# Altium schematic sheet RP2350B.SchDoc
size A4; SheetNumber: 1; SheetTotal: 1
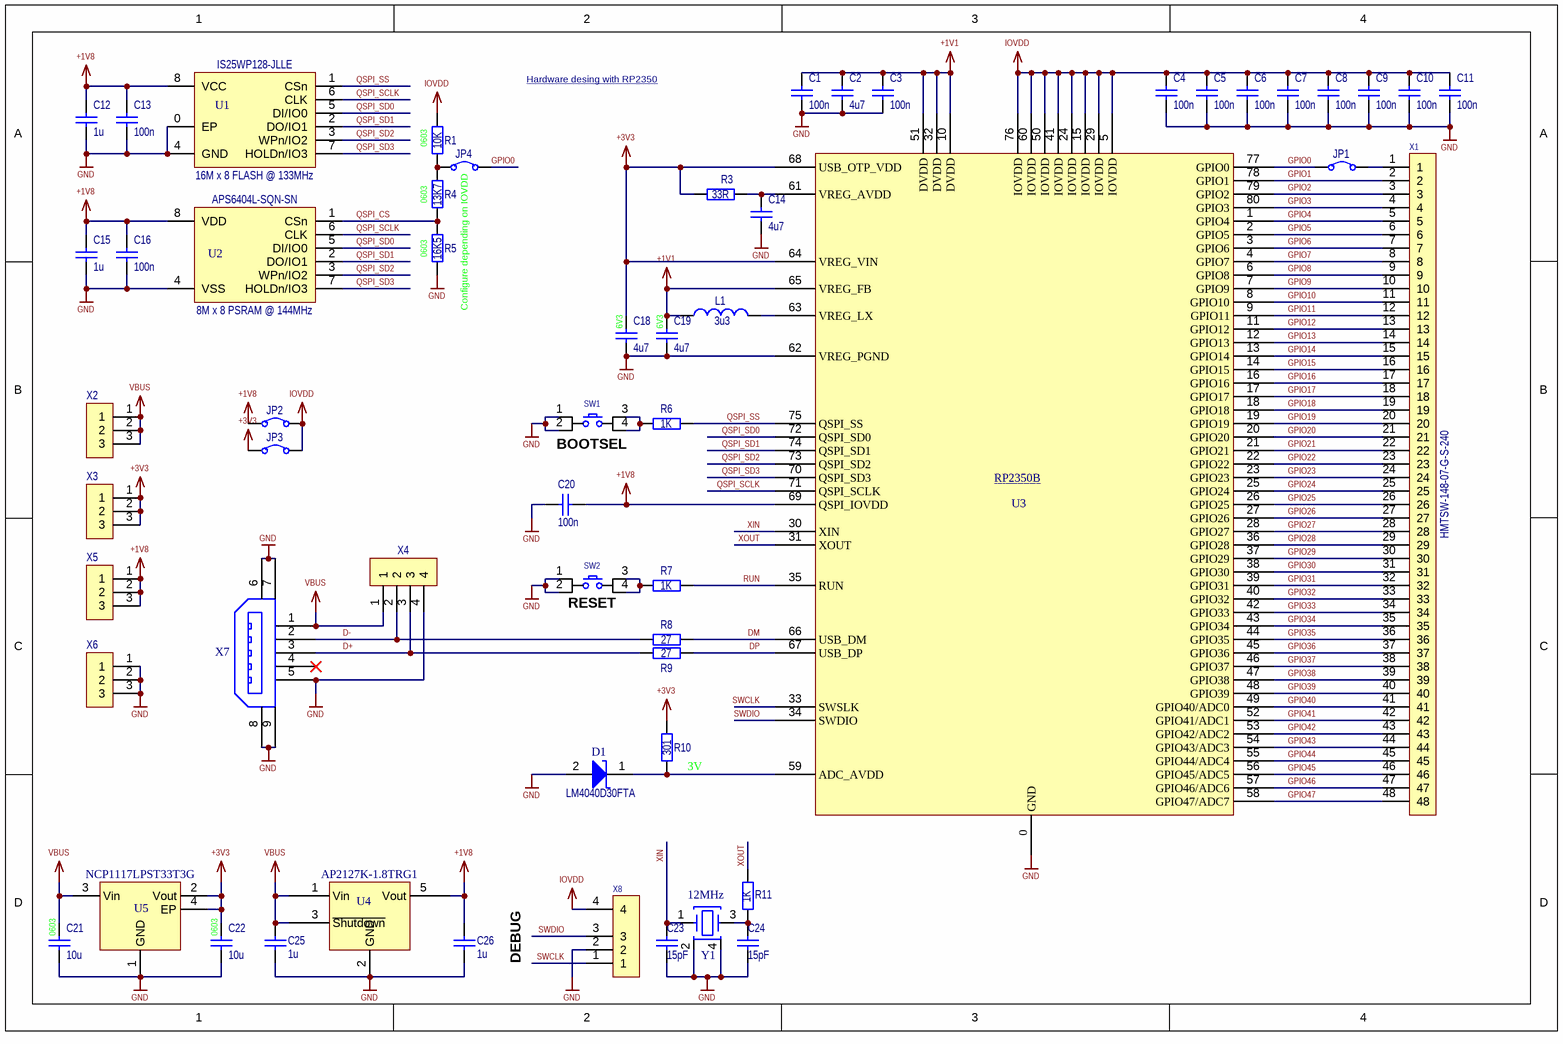
[diagram p0: RP2350B.SchDoc]

## Parts
C1  value 100n  [CAPC0402]  (hidden comment: C0402C104J8RACTU)
C2  value 4u7  [CAPC0402]  (hidden comment: CL05A475KP5NRNC)
C3  value 100n  [CAPC0402]  (hidden comment: C0402C104J8RACTU)
C4  value 100n  [CAPC0402]  (hidden comment: C0402C104J8RACTU)
C5  value 100n  [CAPC0402]  (hidden comment: C0402C104J8RACTU)
C6  value 100n  [CAPC0402]  (hidden comment: C0402C104J8RACTU)
C7  value 100n  [CAPC0402]  (hidden comment: C0402C104J8RACTU)
C8  value 100n  [CAPC0402]  (hidden comment: C0402C104J8RACTU)
C9  value 100n  [CAPC0402]  (hidden comment: C0402C104J8RACTU)
C10  value 100n  [CAPC0402]  (hidden comment: C0402C104J8RACTU)
C11  value 100n  [CAPC0402]  (hidden comment: C0402C104J8RACTU)
C12  value 1u  [CAPC0402]  (hidden comment: CL05A105KP5NNNC)
C13  value 100n  [CAPC0402]  (hidden comment: C0402C104J8RACTU)
C14  value 4u7  [CAPC0402]  (hidden comment: CL05A475KP5NRNC)
C15  value 1u  [CAPC0402]  (hidden comment: CL05A105KP5NNNC)
C16  value 100n  [CAPC0402]  (hidden comment: C0402C104J8RACTU)
C18  6V3  value 4u7  [CAPC0603]
C19  6V3  value 4u7  [CAPC0603]
C20  value 100n  [CAPC0402]  (hidden comment: C0402C104J8RACTU)
C21  0603  value 10u  [CAPC0603]
C22  0603  value 10u  [CAPC0603]
C23  value 15pF  [CAPC0402]  (hidden comment: GJM1555C1H3R0BB01D)
C24  value 15pF  [CAPC0402]  (hidden comment: GJM1555C1H3R0BB01D)
C25  value 1u  [CAPC0402]  (hidden comment: CL05A105KP5NNNC)
C26  value 1u  [CAPC0402]  (hidden comment: CL05A105KP5NNNC)
D1  LM4040D30FTA  value 3V  [SOT23-3]
JP1  5110 Keystone  [JumperSMD_0603]  (value not drawn)  (no BOM)
JP2  5110 Keystone  [JumperSMD_0603]  (value not drawn)  (no BOM)
JP3  5110 Keystone  [JumperSMD_0603]  (value not drawn)  (no BOM)
JP4  5110 Keystone  [JumperSMD_0603]  (value not drawn)  (no BOM)
L1  value 3u3  [IND_0806]  (hidden comment: IND_3u3_2X1.6mm_1.4A_20%)
R1  0603  value 10K  [RESC0603]
R3  value 33R  [RESC0402]  (hidden comment: RC0402FR-0733RL)
R4  0603  value 13K7  [RESC0603]
R5  0603  value 16K5  [RESC0603]
R6  value 1K  [RESC0402]  (hidden comment: RC0402FR-071KL)
R7  value 1K  [RESC0402]  (hidden comment: RC0402FR-071KL)
R8  value 27  [RESC0402]  (hidden comment: CRCW040214K3FKED)
R9  value 27  [RESC0402]  (hidden comment: CRCW040214K3FKED)
R10  value 301  [RESC0402]  (hidden comment: 301R_0402_63mW_1%_100ppm)
R11  value 1K  [RESC0402]  (hidden comment: RC0402FR-071KL)
SW1  434133025816  [434133025816]  (value not drawn)
SW2  434133025816  [434133025816]  (value not drawn)
U1  value 16M x 8 FLASH @ 133MHz  [WSON8-6x8]  (hidden comment: IS25WP128-JLLE)
U2  value 8M x 8 PSRAM @ 144MHz  [SOP-8L (150)]  (hidden comment: APS6404L-SQN-SN)
U3  RP2350B  [QFN-80]  (value not drawn)
U4  AP2127K-1.8TRG1  [SOT23-5]
U5  NCP1117LPST33T3G  [SOT-232-4]
X1  HMTSW-148-07-G-S-240  [HDR_TH_1X48_M_00]
X2  825433-3  [HDR_TH_1X3_M_00]  (value not drawn)
X3  825433-3  [HDR_TH_1X3_M_00]  (value not drawn)
X4  HMTSW-104-07-G-S-240  [HDR_TH_1X4_M_00]  (value not drawn)
X5  825433-3  [HDR_TH_1X3_M_00]  (value not drawn)
X6  825433-3  [HDR_TH_1X3_M_00]  (value not drawn)
X7  1734327-1  [1734327-1]  (value not drawn)
X8  HMTSW-106-07-G-S-240  [HDR_TH_1X3+0+1_M_00]  (value not drawn)
Y1  value 12MHz  [ABM8]  (hidden comment: ABM8-272-T3)

## Nets
+1V1: C1.2 C2.2 C3.2 C19.2 L1.1 U3.10(DVDD) U3.32(DVDD) U3.51(DVDD) U3.65(VREG_FB)
+1V8: C12.1 C13.2 C15.1 C16.2 C20.2 C26.1 JP2.1 U1.8(VCC) U2.8(VDD) U3.69(QSPI_IOVDD) U4.5(Vout) X5.1 X5.2 X5.3
+3V3: C18.2 C22.2 JP3.1 R3.1 R10.2 U3.64(VREG_VIN) U3.68(USB_OTP_VDD) U5.2(Vout) U5.4(EP) X3.1 X3.2 X3.3
GND: C1.1 C2.1 C3.1 C4.1 C5.1 C6.1 C7.1 C8.1 C9.1 C10.1 C11.1 C12.2 C13.1 C14.1 C15.2 C16.1 C18.1 C19.1 C20.1 C21.1 C22.1 C23.1 C24.1 C25.2 C26.2 D1.2(Anode) R5.1 SW1.1 SW1.2 SW2.1 SW2.2 U1.0(EP) U1.4(GND) U2.4(VSS) U3.0(GND) U3.62(VREG_PGND) U4.2(GND) U5.1(GND) X4.4 X6.1 X6.2 X6.3 X7.5 X7.6 X7.7 X7.8 X7.9 X8.2 Y1.2(GND) Y1.4(GND)
IOVDD: C4.2 C5.2 C6.2 C7.2 C8.2 C9.2 C10.2 C11.2 JP2.2 JP3.2 R1.2 U3.5(IOVDD) U3.15(IOVDD) U3.24(IOVDD) U3.29(IOVDD) U3.41(IOVDD) U3.50(IOVDD) U3.60(IOVDD) U3.76(IOVDD) X8.4
VBUS: C21.2 C25.1 U4.1(Vin) U4.3(~{Shutdown}) U5.3(Vin) X2.1 X2.2 X2.3 X4.1 X7.1
D+: R9.1 X4.3 X7.3
D-: R8.1 X4.2 X7.2
DM: R8.2 U3.66(USB_DM)
DP: R9.2 U3.67(USB_DP)
GPIO0: JP1.1 JP4.2 U3.77(GPIO0)
GPIO1: U3.78(GPIO1) X1.2
GPIO2: U3.79(GPIO2) X1.3
GPIO3: U3.80(GPIO3) X1.4
GPIO4: U3.1(GPIO4) X1.5
GPIO5: U3.2(GPIO5) X1.6
GPIO6: U3.3(GPIO6) X1.7
GPIO7: U3.4(GPIO7) X1.8
GPIO8: U3.6(GPIO8) X1.9
GPIO9: U3.7(GPIO9) X1.10
GPIO10: U3.8(GPIO10) X1.11
GPIO11: U3.9(GPIO11) X1.12
GPIO12: U3.11(GPIO12) X1.13
GPIO13: U3.12(GPIO13) X1.14
GPIO14: U3.13(GPIO14) X1.15
GPIO15: U3.14(GPIO15) X1.16
GPIO16: U3.16(GPIO16) X1.17
GPIO17: U3.17(GPIO17) X1.18
GPIO18: U3.18(GPIO18) X1.19
GPIO19: U3.19(GPIO19) X1.20
GPIO20: U3.20(GPIO20) X1.21
GPIO21: U3.21(GPIO21) X1.22
GPIO22: U3.22(GPIO22) X1.23
GPIO23: U3.23(GPIO23) X1.24
GPIO24: U3.25(GPIO24) X1.25
GPIO25: U3.26(GPIO25) X1.26
GPIO26: U3.27(GPIO26) X1.27
GPIO27: U3.28(GPIO27) X1.28
GPIO28: U3.36(GPIO28) X1.29
GPIO29: U3.37(GPIO29) X1.30
GPIO30: U3.38(GPIO30) X1.31
GPIO31: U3.39(GPIO31) X1.32
GPIO32: U3.40(GPIO32) X1.33
GPIO33: U3.42(GPIO33) X1.34
GPIO34: U3.43(GPIO34) X1.35
GPIO35: U3.44(GPIO35) X1.36
GPIO36: U3.45(GPIO36) X1.37
GPIO37: U3.46(GPIO37) X1.38
GPIO38: U3.47(GPIO38) X1.39
GPIO39: U3.48(GPIO39) X1.40
GPIO40: U3.49(GPIO40/ADC0) X1.41
GPIO41: U3.52(GPIO41/ADC1) X1.42
GPIO42: U3.53(GPIO42/ADC2) X1.43
GPIO43: U3.54(GPIO43/ADC3) X1.44
GPIO44: U3.55(GPIO44/ADC4) X1.45
GPIO45: U3.56(GPIO45/ADC5) X1.46
GPIO46: U3.57(GPIO46/ADC6) X1.47
GPIO47: U3.58(GPIO47/ADC7) X1.48
QSPI_CS: R4.1 R5.2 U2.1(CSn)
QSPI_SCLK: U1.6(CLK) U2.6(CLK) U3.71(QSPI_SCLK)
QSPI_SD0: U1.5(DI/IO0) U2.5(DI/IO0) U3.72(QSPI_SD0)
QSPI_SD1: U1.2(DO/IO1) U2.2(DO/IO1) U3.74(QSPI_SD1)
QSPI_SD2: U1.3(WPn/IO2) U2.3(WPn/IO2) U3.73(QSPI_SD2)
QSPI_SD3: U1.7(HOLDn/IO3) U2.7(HOLDn/IO3) U3.70(QSPI_SD3)
QSPI_SS: R6.2 U1.1(CSn) U3.75(QSPI_SS)
RUN: R7.2 U3.35(RUN)
SWCLK: U3.33(SWSLK) X8.1
SWDIO: U3.34(SWDIO) X8.3
XIN: C23.2 U3.30(XIN) Y1.1(IN)
XOUT: R11.2 U3.31(XOUT)
NetC14_2: C14.2 R3.2 U3.61(VREG_AVDD)
NetC24_2: C24.2 R11.1 Y1.3(OUT)
NetD1_1: D1.1(Cathode) R10.1 U3.59(ADC_AVDD)
NetJP1_2: JP1.2 X1.1
NetJP4_1: JP4.1 R1.1 R4.2
NetL1_2: L1.2 U3.63(VREG_LX)
NetR6_1: R6.1 SW1.3 SW1.4
NetR7_1: R7.1 SW2.3 SW2.4

Not connected (* = marked no-connect by the designer): X7 4*

## Notes on the sheet
- Hardware desing with RP2350 <https://datasheets.raspberrypi.com/rp2350/hardware-design-with-rp2350.pdf>
- (near JP4) Configure depending on IOVDD
- (near SW1) BOOTSEL
- (near SW2) RESET
- (near C26) DEBUG
- designed by
- reviewed by
- last drawn by
- Workspace:
- Altium Rev.:
- Project:
- Schematic:
- last printed
- DIN-A4 L
- Rev.
- sheets
- of
- File:

## Library data of the parts
C1 = 100n_0402_10V_X7R_5%: Capacitor; Ceramic; 100n; 2; 10V; X7R; 5%; -55°C ~ 125°C; Manufacturer 1: KEMET; Manufacturer Part Number 1: C0402C104J8RACTU; Supplier 1: DigiKey; Supplier Part Number 1: 399-8942-6-ND; ComponentLink1Description: Datasheet; ComponentLink1URL: https://content.kemet.com/datasheets/KEM_C1002_X7R_SMD.pdf; ComponentLink2Description: Supplier Info; ComponentLink2URL: https://www.digikey.com/en/products/detail/kemet/C0402C104J8RACTU/2196231?s=N4IgTCBcDaIMwE4EFoAcCAsZkDZkDkAREAXQF8g
C2 C14 = 4u7_0402_10V_X5R_10%: Capacitor; Ceramic; 4.7u; 0402; 10V; X5R; 10%; -55°C ~ 85°C; Manufacturer: Samsung Electro-Mechanics; Manufacturer Part Number: CL05A475KP5NRNC; Supplier 1: DigiKey; Supplier Part Number 1: 1276-1480-6-ND; ComponentLink1Description: Datasheet; ComponentLink1URL: https://media.digikey.com/pdf/Data%20Sheets/Samsung%20PDFs/CL05A475KP5NRNC_Spec.pdf; ComponentLink2Description: Supplier Info; ComponentLink2URL: https://www.digikey.com/en/products/detail/samsung-electro-mechanics/CL05A475KP5NRNC/3887138?s=N4IgTCBcDaIIxgOwDYC0cAsAOADKtAcgCIgC6AvkA
C3-C11 C13 C16 C20 = 100n_0402_10V_X7R_5%: Capacitor; Ceramic; 100n; 0402; 10V; X7R; 5%; -55°C ~ 125°C; Manufacturer 1: KEMET; Manufacturer Part Number 1: C0402C104J8RACTU; Supplier 1: DigiKey; Supplier Part Number 1: 399-8942-6-ND; ComponentLink1Description: Datasheet; ComponentLink1URL: https://content.kemet.com/datasheets/KEM_C1002_X7R_SMD.pdf; ComponentLink2Description: Supplier Info; ComponentLink2URL: https://www.digikey.com/en/products/detail/kemet/C0402C104J8RACTU/2196231?s=N4IgTCBcDaIMwE4EFoAcCAsZkDZkDkAREAXQF8g
C12 C15 C25 C26 = 1u_0402_10V_X5R_10%: Capacitor; Ceramic; 1u; 0402; 10V; X5R; 10%; -55°C ~ 85°C; Manufacturer: Samsung Electro-Mechanics; Manufacturer Part Number: CL05A105KP5NNNC; Supplier 1: DigiKey; Supplier Part Number 1: 1276-1076-6-ND; ComponentLink1Description: Datasheet; ComponentLink1URL: https://www.samsungsem.com/resources/file/global/support/product_catalog/MLCC.pdf; ComponentLink2Description: Supplier Info; ComponentLink2URL: https://www.digikey.com/en/products/detail/samsung-electro-mechanics/CL05A105KP5NNNC/3886734?s=N4IgTCBcDaIIxgOwDYC0cAMLVoHIBEQBdAXyA
C18 C19 = 4u7_0603_6V3_X7S_10%: Capacitor; Ceramic; 4.7u; 0603; 6.3V; X7S; 10%; -55°C ~ 125°C; Manufacturer: Murata Electronics; Manufacturer Part Number: GCJ188C70J475KE02D; Supplier 1: DigiKey; Supplier Part Number 1: 490-16480-1-ND; ComponentLink1Description: Datasheet; ComponentLink1URL: https://search.murata.co.jp/Ceramy/image/img/A01X/G101/ENG/GCJ188C70J475KE02-01.pdf; ComponentLink2Description: Supplier Info; ComponentLink2URL: https://www.digikey.de/en/products/detail/murata-electronics/GCJ188C70J475KE02D/7363224
C21 C22 = 10u_0603_16V_X5R_10%: Capacitor; Ceramic; 10u; 0603; 16V; X5R; 10%; -55°C ~ 85°C; Manufacturer 1: Murata Electronics; Manufacturer Part Number 1: GRM188R61C106KAALD; Supplier 1: DigiKey; Supplier Part Number 1: 490-10728-6-ND; ComponentLink1Description: Datasheet; ComponentLink1URL: https://search.murata.co.jp/Ceramy/image/img/A01X/G101/ENG/GRM188R61C106KAAL-01.pdf; ComponentLink2Description: Supplier Info; ComponentLink2URL: https://www.digikey.com/en/products/detail/murata-electronics/GRM188R61C106KAALD/4905338?s=N4IgTCBcDaICwE4AMBaAjEg7GAHCgbCgHIAiIAugL5A
C23 C24 = 15p_0402_25V_C0G/NP0_5%: Capacitor; Ceramic; 15p; 0402; 25V; C0G/NP0; +/-5%; -55°C ~ 125°C; Manufacturer: YAGEO; Manufacturer Part Number: CC0402JRNPO8BN150; Supplier 1: DigiKey; Supplier Part Number 1: 311-3746-1-ND; ComponentLink1Description: Datasheet; ComponentLink1URL: https://www.yageo.com/upload/media/product/productsearch/datasheet/mlcc/UPY-GP_NP0_16V-to-50V_18.pdf; ComponentLink2Description: Supplier Info; ComponentLink2URL: https://www.digikey.de/en/products/detail/yageo/CC0402JRNPO8BN150/5883268
D1 = LM4040D30FTA: Shunt Voltage Reference IC Fixed 3V ±1% 15 mA SOT-23-3; Manufacturer: Diodes Incorporated; ComponentLink1Description: Datasheet; ComponentLink1URL: https://www.diodes.com/assets/Datasheets/LM4040.pdf; ComponentLink2Description: Supplier Info; ComponentLink2URL: https://www.digikey.de/en/products/detail/diodes-incorporated/LM4040D30FTA/4249974; Manufacturer Part Number: LM4040D30FTA; Supplier 1: Digi-Key; Supplier Part Number 1: LM4040D30FTADICT-ND
JP1-JP4 = JMP_0R_0603: Jumper; Chip; 0R; 0603; 500mW; Manufacturer Part Number: 5110; ComponentLink1Description: Datasheet; ComponentLink1URL: https://www.keyelco.com/userAssets/file/M65p54.pdf; ComponentLink2Description: Supplier Info; ComponentLink2URL: https://www.digikey.com/en/products/detail/keystone-electronics/5110/5118870?s=N4IgTCBcDaINIFMCeBnALgewHYIAQFYBGQgBhAF0BfIA; Manufacturer: Keystone; Supplier 1: DigiKey; Supplier Part Number 1: 36-5110CT-ND; Value: 0R
L1 = IND_3u3_2X1.6mm_1.4A_20%: 3.3 µH Shielded Inductor 1.4 A 225mOhm Max 0806; Manufacturer: Bourns Inc.; Manufacturer Part Number: SRP2010DPA-3R3M; ComponentLink1Description: Supplier Info; ComponentLink1URL: https://www.digikey.de/en/products/detail/bourns-inc/SRP2010DPA-3R3M/16185975?s=N4IgTCBcDaIMoCUAKYAMBGVARJBBAtAMwKECyIAugL5A; ComponentLink2Description: Datasheet; ComponentLink2URL: https://mm.digikey.com/Volume0/opasdata/d220001/medias/docus/5338/SRP2010DPA_Series_DS.pdf; Supplier 1: Digi-Key; Supplier Part Number 1: 118-SRP2010DPA-3R3MCT-ND
R1 = 10K_0603_100mW_1%_100ppm: Resistor; Chip; 10k; 0603; 75V; 1%; 100ppm; 100mW; -55°C ~ 155°C; Manufacturer 1: Yageo; Manufacturer Part Number 1: RC0603FR-0710KL; Supplier 1: DigiKey; Supplier Part Number 1: 311-10.0KHRDKR-ND; ComponentLink1Description: Datasheet; ComponentLink1URL: https://www.yageo.com/upload/media/product/productsearch/datasheet/rchip/PYu-RC_Group_51_RoHS_L_11.pdf; ComponentLink2Description: Supplier Info; ComponentLink2URL: https://www.digikey.com/en/products/detail/yageo/RC0603FR-0710KL/726880?s=N4IgTCBcDaIMwEYEFoEAYB0aDSAJASgCLb7IByhIAugL5A
R3 = 33R_0402_63mW_1%_100ppm: Resistor; Chip; 33R; 0402; 50V; 1%; 100ppm; 63mW; -55°C ~ 155°C; Manufacturer: Yageo; Manufacturer Part Number: RC0402FR-0733RL; Supplier 1: DigiKey; Supplier Part Number 1: 311-33.0LRDKR-ND; ComponentLink1Description: Datasheet; ComponentLink1URL: https://www.yageo.com/upload/media/product/productsearch/datasheet/rchip/PYu-RC_Group_51_RoHS_L_11.pdf; ComponentLink2Description: Supplier Info; ComponentLink2URL: https://www.digikey.com/en/products/detail/yageo/RC0402FR-0733RL/726593?s=N4IgTCBcDaIMwEYEFo5wHQAYAyAlAIgNK7IBy%2BIAugL5A
R4 = 13K7_0603_100mW_0.1%_25ppm: Resistor; Chip; 13K7; 0603; 0.1%; 25ppm; 100mW; -55°C ~ 155°C; Manufacturer: YAGEO; Manufacturer Part Number: RT0603BRD0713K7L; Supplier 1: DigiKey; ComponentLink1Description: Datasheet; ComponentLink1URL: https://www.yageo.com/upload/media/product/app/datasheet/rchip/pyu-rt_1-to-0.01_rohs_l.pdf; ComponentLink2Description: Supplier Info; ComponentLink2URL: https://www.digikey.de/en/products/detail/yageo/RT0603BRD0713K7L/1072241; Supplier Part Number 1: YAG4473CT-ND
R5 = 16K5_0603_100mW_0.1%_25ppm: Resistor; Chip; 16K5; 0603; 0.1%; 25ppm; 100mW; -55°C ~ 155°C; Manufacturer: YAGEO; Manufacturer Part Number: RT0603BRD0716K5L; Supplier 1: DigiKey; ComponentLink1Description: Datasheet; ComponentLink1URL: https://www.yageo.com/upload/media/product/app/datasheet/rchip/pyu-rt_1-to-0.01_rohs_l.pdf; ComponentLink2Description: Supplier Info; ComponentLink2URL: https://www.digikey.de/en/products/detail/yageo/RT0603BRD0716K5L/1072278; Supplier Part Number 1: YAG1544CT-ND
R6 R7 R11 = 1K_0402_63mW_1%_100ppm: Resistor; Chip; 1k; 0402; 50V; 1%; 100ppm; 63mW; -55°C ~ 155°C; Manufacturer: Yageo; Manufacturer Part Number: RC0402FR-071KL; Supplier 1: DigiKey; Supplier Part Number 1: 311-1.00KLRDKR-ND; ComponentLink1Description: Datasheet; ComponentLink1URL: https://www.yageo.com/upload/media/product/productsearch/datasheet/rchip/PYu-RC_Group_51_RoHS_L_11.pdf; ComponentLink2Description: Supplier Info; ComponentLink2URL: https://www.digikey.com/en/products/detail/yageo/RC0402FR-071KL/726513?s=N4IgTCBcDaIMwEYEFoEDoAMGDSAZASgCLb7IByhIAugL5A
R8 R9 = 27R_0402_63mW_1%_100ppm: Resistor; Chip; 27Ohm; 0402; 1%; 100ppm; 63mW; -55°C ~ 155°C; Manufacturer: YAGEO; Manufacturer Part Number: RC0402FR-0727RL; Supplier 1: DigiKey; Supplier Part Number 1: YAG3086CT-ND; ComponentLink1Description: Datasheet; ComponentLink1URL: https://www.yageo.com/upload/media/product/products/datasheet/rchip/PYu-RC_Group_51_RoHS_L_12.pdf; ComponentLink2Description: Supplier Info; ComponentLink2URL: https://www.digikey.de/en/products/detail/yageo/RC0402FR-0727RL/5280946
R10 = 301R_0402_63mW_1%_100ppm: Resistor; Chip; 301R; 0402; 1%; 100ppm; 63mW; -55°C ~ 155°C; Manufacturer: YAGEO; Manufacturer Part Number: RC0402FR-07301RL; Supplier 1: DigiKey; ComponentLink1Description: Datasheet; ComponentLink1URL: https://www.yageo.com/upload/media/product/products/datasheet/rchip/PYu-RC_Group_51_RoHS_L_12.pdf; ComponentLink2Description: Supplier Info; ComponentLink2URL: https://www.digikey.de/en/products/detail/yageo/RC0402FR-07301RL/726591; Supplier Part Number 1: 311-301LRCT-ND
SW1 SW2 = 434133025816: SWITCH TACTILE SPST-NO 0.05A 16V; Manufacturer: Würth Elektronik; ComponentLink1Description: Datasheet; ComponentLink1URL: https://www.we-online.com/components/products/datasheet/434133025816.pdf; ComponentLink2Description: Supplier Info; ComponentLink2URL: https://www.digikey.de/en/products/detail/w%C3%BCrth-elektronik/434133025816/9950810?s=N4IgTCBcDaICwGY4EYEIAxgKwA5kDYQBdAXyA; Manufacturer Part Number: 434133025816; Supplier 1: Digi-Key; Supplier Part Number 1: 732-13663-1-ND
U1 = IS25WP128-JLLE: IC FLASH 128MBIT SPI/QUAD 8WSON; Manufacturer: ISSI, Integrated Silicon Solution Inc; ComponentLink1Description: Datasheet; ComponentLink1URL: https://www.issi.com/WW/pdf/25WP128.pdf; ComponentLink2Description: Supplier Info; ComponentLink2URL: https://www.digikey.de/en/products/detail/issi-integrated-silicon-solution-inc/IS25WP128-JLLE/7567476; Supplier 1: Digi-Key; Supplier Part Number 1: 706-1625-ND; Manufacturer Part Number: IS25WP128-JLLE
U2 = APS6404L-SQN-SN: IC PSRAM 64MBIT QSPI SOP-8L; Manufacturer: AP Memory; ComponentLink1Description: Datasheet; ComponentLink1URL: https://www.mouser.de/datasheet/2/1127/APM_PSRAM_QSPI_APS6404L_SQN_v3_6_PKG-1954836.pdf; ComponentLink2Description: Supplier Info; ComponentLink2URL: https://www.mouser.de/ProductDetail/AP-Memory/APS6404L-SQN-SN?qs=sGAEpiMZZMutXGli8Ay4kD40unR62EiRpDwP77v2d3Y%3D; Supplier 1: Mouser; Supplier Part Number 1: 878-APS6404L-SQN-SN; Manufacturer Part Number: APS6404L-SQN-SN
U3 = RP2350B: IC MCU 32BIT EXT MEM 80QFN; Manufacturer 1: Raspberry Pi; ComponentLink1Description: Datasheet; ComponentLink1URL: https://datasheets.raspberrypi.com/rp2350/rp2350-datasheet.pdf; ComponentLink2Description: Supplier Info; Manufacturer Part Number 1: RP2350B
U4 = AP2127K-1.8TRG1: IC REG LINEAR 1.8V 300MA SOT23-5; Manufacturer: Diodes Incorporated; ComponentLink1Description: Datasheet; ComponentLink1URL: https://www.diodes.com/assets/Datasheets/AP2127.pdf; ComponentLink2Description: Supplier Info; ComponentLink2URL: https://www.digikey.de/en/products/detail/diodes-incorporated/AP2127K-1-8TRG1/4470784; Supplier 1: Digi-Key; Supplier Part Number 1: AP2127K-1.8TRG1DICT-ND; Manufacturer Part Number: AP2127K-1.8TRG1
U5 = NCP1117LPST33T3G: IC REG LINEAR 3.3V 1A SOT223; Manufacturer: onsemi; ComponentLink1Description: Datasheet; ComponentLink1URL: https://www.onsemi.com/pdf/datasheet/ncp1117lp-d.pdf; ComponentLink2Description: Supplier Info; ComponentLink2URL: https://www.digikey.de/en/products/detail/onsemi/NCP1117LPST33T3G/2194024; Manufacturer Part Number: NCP1117LPST33T3G; Supplier 1: DigiKey; Supplier Part Number 1: NCP1117LPST33T3GOSCT-ND
X1 = HDR_TH_1X48_M_00: Header; 1x48 pins; Male; Straight; Pitch 2.54mm; Samtec HMTSW Series; Manufacturer 1: Samtec Inc.; ComponentLink1Description: Supplier Info; ComponentLink2Description: Datasheet; ComponentLink2URL: https://www.samtec.com/products/hmtsw-148-07-g-s-240; Manufacturer Part Number 1: HMTSW-148-07-G-S-240; Supplier 1: DigiKey; Supplier Part Number 1: 612-HMTSW-148-07-G-S-240-ND
X2 X3 X5 X6 = HDR_TH_1X3_M_00: Header; 1x3 pins; Male; Straight; Pitch 2.54mm; Manufacturer: TE Connectivity; Manufacturer Part Number: 825433-2; ComponentLink1Description: Supplier Info; ComponentLink1URL: https://www.digikey.de/product-detail/en/te-connectivity-amp-connectors/825433-3/A106465-ND/2054408; ComponentLink2Description: Datasheet; ComponentLink2URL: https://www.te.com/commerce/DocumentDelivery/DDEController?Action=srchrtrv&DocNm=825433&DocType=Customer+Drawing&DocLang=English; Supplier 1: Digi-Key; Supplier Part Number 1: A106465-ND; Value: HDR_TH_1X3_M_00
X4 = HDR_TH_1X4_M_00: Header; 1x4 pins; Male; Straight; Pitch 2.54mm; Samtec HMTSW Series; Manufacturer 1: Samtec Inc.; ComponentLink1Description: Supplier Info; ComponentLink1URL: https://www.digikey.de/en/products/detail/samtec-inc/HMTSW-104-07-G-S-240/8450698; ComponentLink2Description: Datasheet; ComponentLink2URL: https://mm.digikey.com/Volume0/opasdata/d220001/medias/docus/6129/hmtsw-xxx-xx-xxx-x-xxxx-xx-xx-mkt.pdf; Manufacturer Part Number 1: HMTSW-104-07-G-S-240; Supplier 1: Digi-Key; Supplier Part Number 1: HMTSW-104-07-G-S-240-ND; Value: HDR_TH_1X4_M_00
X7 = 1734327-1: USB - mini A USB 2.0 Receptacle Connector 5 Position Surface Mount, Right Angle; Manufacturer: TE Connectivity AMP Connectors; ComponentLink1Description: Datasheet; ComponentLink1URL: https://www.mouser.de/datasheet/2/418/7/ENG_CD_1734327_D1-2016926.pdf; ComponentLink2Description: Supplier Info; ComponentLink2URL: https://www.digikey.de/en/products/detail/te-connectivity-amp-connectors/1734327-1/1891548; Manufacturer Part Number: 1734327-1; Supplier 1: Digi-Key; Supplier Part Number 1: A123107-ND; Value: 1734327-1
X8 = HDR_TH_1X3+1_M_00: Header; 1x5 pins (with key); Male; Straight; Pitch 2.54mm; Samtec HMTSW Series; Manufacturer: Samtec Inc.; Manufacturer Part Number: HMTSW-105-07-G-S-240; ComponentLink1Description: Supplier Info; ComponentLink1URL: https://www.digikey.de/en/products/detail/samtec-inc/HMTSW-105-07-G-S-240/8451402; ComponentLink2Description: Datasheet; ComponentLink2URL: http://suddendocs.samtec.com/catalog_english/mtsw.pdf; Supplier 1: DigiKey; Supplier Part Number 1: 612-HMTSW-105-07-G-S-240-ND; Value: HDR_TH_1X3+1_M_00
Y1 = ABM8-272-T3: Christal; SMD; 12 MHz ±30ppm; 10pF/50Ohm; Manufacturer: Abracon LLC; ComponentLink1Description: Datasheet; ComponentLink1URL: https://mm.digikey.com/Volume0/opasdata/d220001/medias/docus/6128/ABM8-272-T3.pdf; ComponentLink2Description: Supplier Info; ComponentLink2URL: https://www.digikey.de/en/products/detail/abracon-llc/ABM8-272-T3/22472366; Manufacturer Part Number: ABM8-272-T3; Supplier 1: Digi-Key; Supplier Part Number 1: 535-ABM8-272-T3CT-ND